# Altium project GMSK Prototyping Board.PrjPcb
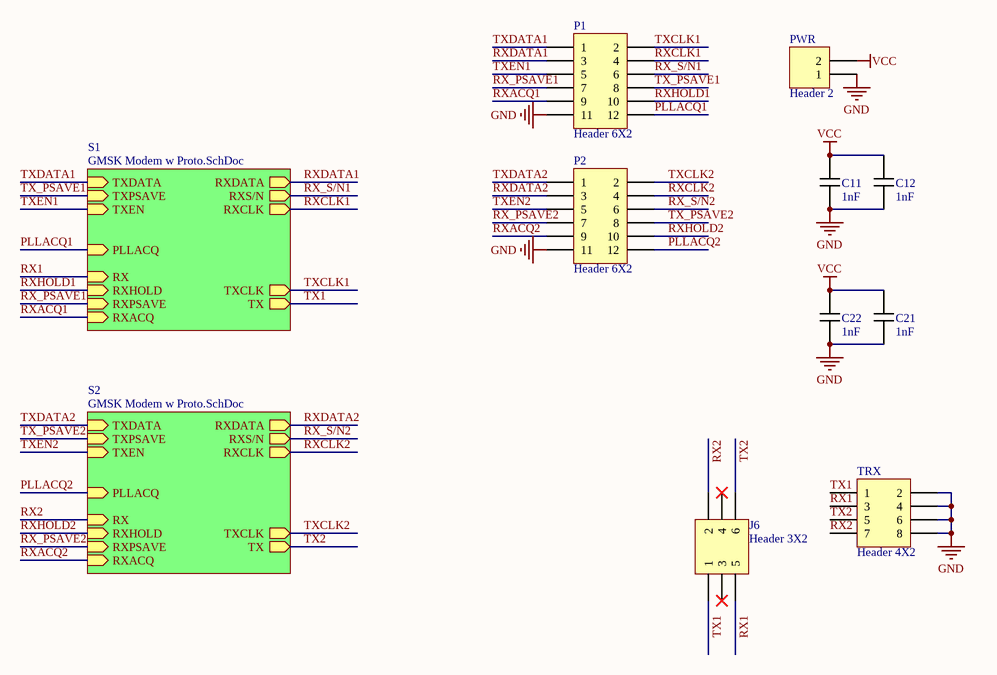
[diagram p0: GMSK Prototyping Board.SchDoc]
2 sheets, 75 parts. Net scope: hierarchical (ports join the sheet entries above them; power ports are global).
Board file: GMSK Prototyping Board.PcbDoc
Sheets:
  GMSK Prototyping Board.SchDoc
    S2 = GMSK Modem w Proto.SchDoc
    S1 = GMSK Modem w Proto.SchDoc

## Sheet GMSK Prototyping Board.SchDoc: GMSK Prototyping Board
size A3; Author: Daniel Jedrychowski; CompanyName: BLUESAT Satellite Project; Engineer: Daniel Jedrychowski; Organization: BLUESat Project; Address1: Room 419; Address2: School of EE&T; Address3: UNSW, NSW 2052; Address4: Australia; DocumentNumber: PAYL0004; SheetNumber: 1; SheetTotal: 2; Description: Board housing 2 GMSK Modems with loopback capability; Version: 1.0

### Parts
C11  value 1nF  [0805 Cap]  (hidden comment: 0805 Cap)
C12  value 1nF  [0805 Cap]  (hidden comment: 0805 Cap)
C21  value 1nF  [0805 Cap]  (hidden comment: 0805 Cap)
C22  value 1nF  [0805 Cap]  (hidden comment: 0805 Cap)
J6  Header 3X2  [HDR2X3]
P1  Header 6X2  [HDR2X6]
P2  Header 6X2  [HDR2X6]
PWR  Header 2  [HDR1X2]
TRX  Header 4X2  [HDR2X4]

### Sub-sheets
S1 = GMSK Modem w Proto.SchDoc: TX (out), RX (in), TXDATA (in), RXDATA (out), RXCLK (out), TXCLK (out), PLLACQ (in), RXACQ (in), TXEN (in), RXHOLD (in), TXPSAVE (in), RXPSAVE (in), RXS/N (out)
S2 = GMSK Modem w Proto.SchDoc: TX (out), RX (in), TXDATA (in), RXDATA (out), RXCLK (out), TXCLK (out), PLLACQ (in), RXACQ (in), TXEN (in), RXHOLD (in), TXPSAVE (in), RXPSAVE (in), RXS/N (out)

### Nets
GND: C11.2 C12.2 C21.1 C22.1 P1.11 P2.11 PWR.1 TRX.2 TRX.4 TRX.6 TRX.8
VCC: C11.1 C12.1 C21.2 C22.2 PWR.2
PLLACQ1: P1.12 ; sheet S1/PLLACQ  [project net PLLACQ]
PLLACQ2: P2.12 ; sheet S2/PLLACQ  [project net PLLACQ]
RX1: J6.5 TRX.3 ; sheet S1/RX  [project net RX]
RX2: J6.2 TRX.7 ; sheet S2/RX  [project net RX]
RX_PSAVE1: P1.7 ; sheet S1/RXPSAVE
RX_PSAVE2: P2.7 ; sheet S2/RXPSAVE
RX_S/N1: P1.6 ; sheet S1/RXS/N
RX_S/N2: P2.6 ; sheet S2/RXS/N
RXACQ1: P1.9 ; sheet S1/RXACQ  [project net RXACQ]
RXACQ2: P2.9 ; sheet S2/RXACQ  [project net RXACQ]
RXCLK1: P1.4 ; sheet S1/RXCLK  [project net RXCLK]
RXCLK2: P2.4 ; sheet S2/RXCLK  [project net RXCLK]
RXDATA1: P1.3 ; sheet S1/RXDATA  [project net RXDATA]
RXDATA2: P2.3 ; sheet S2/RXDATA  [project net RXDATA]
RXHOLD1: P1.10 ; sheet S1/RXHOLD  [project net RXHOLD]
RXHOLD2: P2.10 ; sheet S2/RXHOLD  [project net RXHOLD]
TX1: J6.1 TRX.1 ; sheet S1/TX  [project net TX]
TX2: J6.6 TRX.5 ; sheet S2/TX  [project net TX]
TX_PSAVE1: P1.8 ; sheet S1/TXPSAVE
TX_PSAVE2: P2.8 ; sheet S2/TXPSAVE
TXCLK1: P1.2 ; sheet S1/TXCLK  [project net TXCLK]
TXCLK2: P2.2 ; sheet S2/TXCLK  [project net TXCLK]
TXDATA1: P1.1 ; sheet S1/TXDATA  [project net TXDATA]
TXDATA2: P2.1 ; sheet S2/TXDATA  [project net TXDATA]
TXEN1: P1.5 ; sheet S1/TXEN  [project net TXEN]
TXEN2: P2.5 ; sheet S2/TXEN  [project net TXEN]

Not connected (* = marked no-connect by the designer): J6 3* 4*

### Notes on the sheet
- Title
- Description:
- Size:
- Author:
- Date:
- A3
- Time:
- Version
- Sheet:
- Drawing No.:
- of
- File:

### Library data of the parts
C11 C12 C21 C22 = 0805 MLCC - X7R, 10%
J6 = Header 3X2: Header, 3-Pin, Dual row; LatestRevisionDate: 17-Jul-2002; LatestRevisionNote: Re-released for DXP Platform.; Publisher: Altium Limited
P1 P2 = Header 6X2: Header, 6-Pin, Dual row; LatestRevisionDate: 17-Jul-2002; LatestRevisionNote: Re-released for DXP Platform.; Publisher: Altium Limited
PWR = Header 2: Header, 2-Pin; LatestRevisionDate: 17-Jul-2002; LatestRevisionNote: Re-released for DXP Platform.; Publisher: Altium Limited
TRX = Header 4X2: Header, 4-Pin, Dual row; LatestRevisionDate: 17-Jul-2002; LatestRevisionNote: Re-released for DXP Platform.; Publisher: Altium Limited

## Sheet GMSK Modem w Proto.SchDoc: GMSK Prototyping Board
size A3; CompanyName: BLUESAT Project; Engineer: Daniel Jedrychowski; Organization: BLUESAT Project; Address1: Room 419; Address2: School of EE&T; Address3: UNSW, NSW 2052; Address4: Australia; DocumentNumber: PAYL0005; SheetNumber: 2; SheetTotal: 2; Description: Connections and external components of a GMSK modem; Version: 1.0
Used 2 times, as channels S2, S1. Parts and nets are listed once, with the designators drawn on the sheet.
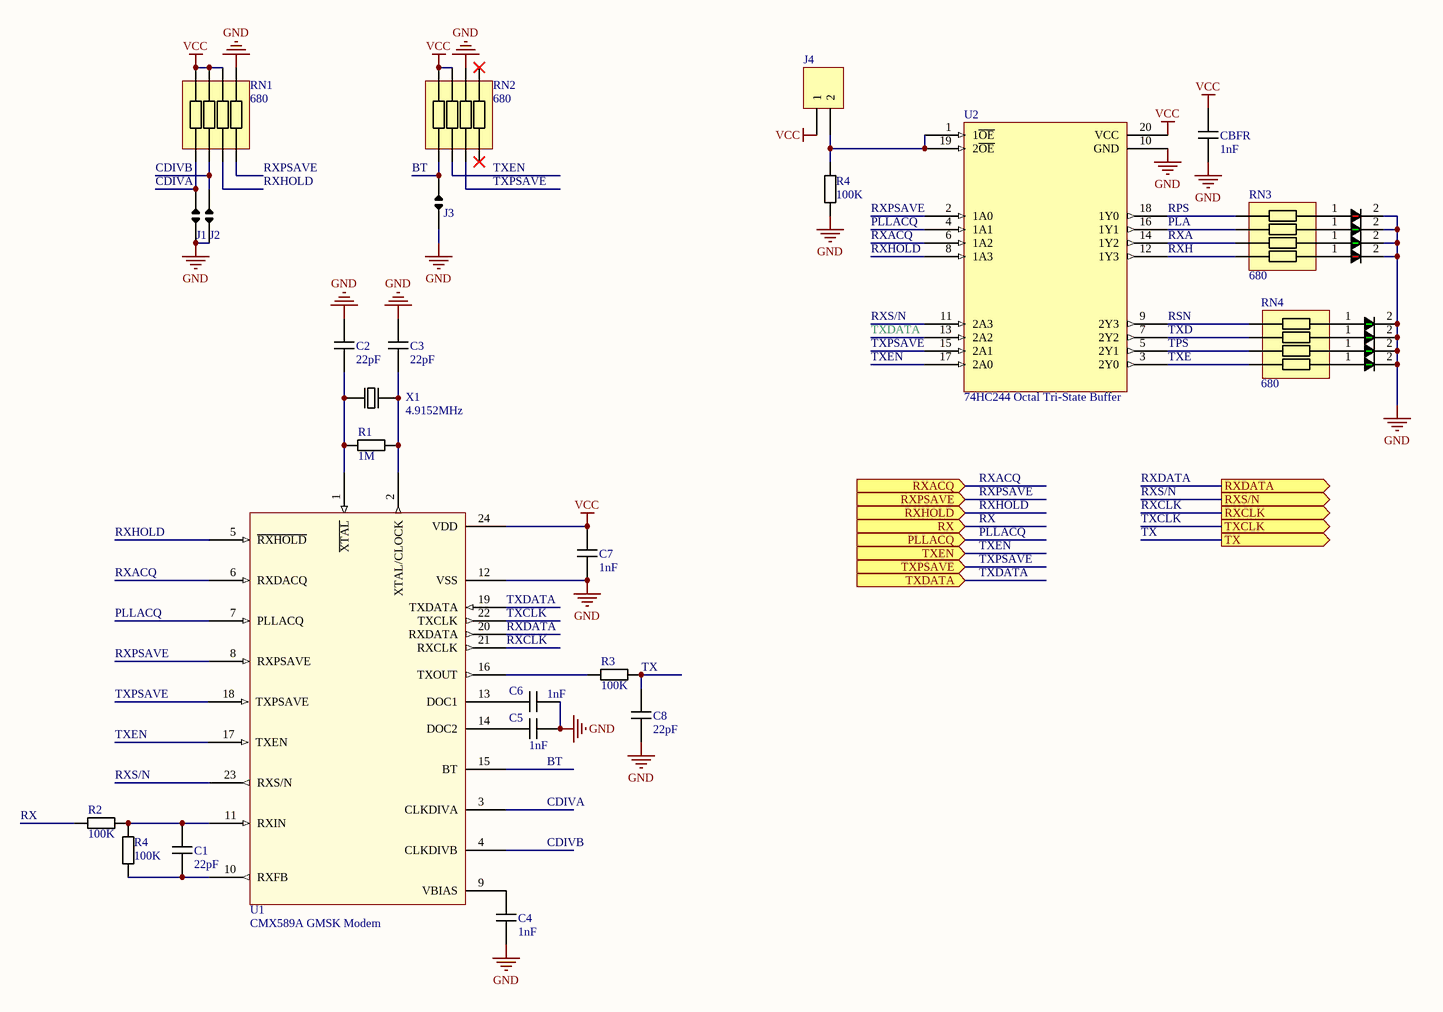
[diagram p1: GMSK Modem w Proto.SchDoc]

### Parts
(Parts that share a designator on the sheet are numbered #1, #2 ... from top to bottom, then left to right.)
C1  value 22pF  [0805 Cap]  (hidden comment: 0805 Cap)
C2  value 22pF  [0805 Cap]  (hidden comment: 0805 Cap)
C3  value 22pF  [0805 Cap]  (hidden comment: 0805 Cap)
C4  value 1nF  [0805 Cap]  (hidden comment: 0805 Cap)
C5  value 1nF  [0805 Cap]  (hidden comment: 0805 Cap)
C6  value 1nF  [0805 Cap]  (hidden comment: 0805 Cap)
C7  value 1nF  [0805 Cap]  (hidden comment: 0805 Cap)
C8  value 22pF  [0805 Cap]  (hidden comment: 0805 Cap)
CBFR  value 1nF  [0805 Cap]  (hidden comment: 0805 Cap)
J1  Jumper  [Solder Jumper C]  (value not drawn)
J2  Jumper  [Solder Jumper C]  (value not drawn)
J3  Jumper  [Solder Jumper C]  (value not drawn)
J4  Header 2  [HDR1X2]  (value not drawn)
PLA1  Green LED  [0603 LED]  (value not drawn)
R1  value 1M  [0805 Resistor]  (hidden comment: 0805 Resistor)
R2  value 100K  [0805 Resistor]  (hidden comment: 0805 Resistor)
R3  value 100K  [0805 Resistor]  (hidden comment: 0805 Resistor)
R4#1  value 100K  [0805 Resistor]  (hidden comment: 0805 Resistor)
R4#2  value 100K  [0805 Resistor]  (hidden comment: 0805 Resistor)
RN1  value 680  [ACAS_0612_AC]  (hidden comment: RN4)
RN2  value 680  [ACAS_0612_AC]  (hidden comment: RN4)
RN3  value 680  [ACAS_0612_AC]  (hidden comment: RN4)
RN4  value 680  [ACAS_0612_AC]  (hidden comment: RN4)
RPS1  Red LED  [0603 LED]  (value not drawn)
RSN1  Green LED  [0603 LED]  (value not drawn)
RXA1  Green LED  [0603 LED]  (value not drawn)
RXH1  Red LED  [0603 LED]  (value not drawn)
TPS1  Green LED  [0603 LED]  (value not drawn)
TXD1  Green LED  [0603 LED]  (value not drawn)
TXE1  Green LED  [0603 LED]  (value not drawn)
U1  CMX589A GMSK Modem  [SOIC24 - GMSK MODEM]
U2  74HC244 Octal Tri-State Buffer  [SOIC20]
X1  value 4.9152MHz  [HC49]  (hidden comment: HC49 Crystal)

### Ports
PLLACQ (in), RX (in), RXACQ (in), RXCLK (out), RXDATA (out), RXHOLD (in), RXPSAVE (in), RXS/N (out), TX (out), TXCLK (out), TXDATA (in), TXEN (in), TXPSAVE (in)

### Nets
GND: C2.2 C3.2 C4.2 C5.2 C6.1 C7.2 C8.2 CBFR.1 J1.1 J2.2 J3.2 PLA1.2 R4#1.1 RN1.1 RN2.6 RPS1.2 RSN1.2 RXA1.2 RXH1.2 TPS1.2 TXD1.2 TXE1.2 U1.12(VSS) U2.10(GND)
VCC: C7.1 CBFR.2 J4.1 RN1.2 RN1.3 RN1.4 RN2.7 RN2.8 U1.24(VDD) U2.20(VCC)
BT: J3.1 RN2.1 U1.15(BT)
CDIVA: J1.2 RN1.5 U1.3(CLKDIVA)
CDIVB: J2.1 RN1.6 U1.4(CLKDIVB)
PLA: RN3.6 U2.16(1Y1)
PLLACQ: U1.7(PLLACQ) U2.4(1A1) ; port PLLACQ
RPS: RN3.5 U2.18(1Y0)
RSN: RN4.5 U2.9(2Y3)
RX: R2.1 ; port RX
RXA: RN3.7 U2.14(1Y2)
RXACQ: U1.6(RXDACQ) U2.6(1A2) ; port RXACQ
RXCLK: U1.21(RXCLK) ; port RXCLK
RXDATA: U1.20(RXDATA) ; port RXDATA
RXH: RN3.8 U2.12(1Y3)
RXHOLD: RN1.7 U1.5(~{RXHOLD}) U2.8(1A3) ; port RXHOLD
RXPSAVE: RN1.8 U1.8(RXPSAVE) U2.2(1A0) ; port RXPSAVE
RXS/N: U1.23(RXS/N) U2.11(2A3) ; port RXS/N
TPS: RN4.7 U2.5(2Y1)
TX: C8.1 R3.2 ; port TX
TXCLK: U1.22(TXCLK) ; port TXCLK
TXD: RN4.6 U2.7(2Y2)
TXDATA: U1.19(TXDATA) U2.13(2A2) ; port TXDATA
TXE: RN4.8 U2.3(2Y0)
TXEN: RN2.2 U1.17(TXEN) U2.17(2A0) ; port TXEN
TXPSAVE: RN2.3 U1.18(TXPSAVE) U2.15(2A1) ; port TXPSAVE
NetC1_1: C1.1 R4#2.2 U1.10(RXFB)
NetC1_2: C1.2 R2.2 R4#2.1 U1.11(RXIN)
NetC2_1: C2.1 R1.1 U1.1(~{XTAL}) X1.1
NetC3_1: C3.1 R1.2 U1.2(XTAL/CLOCK) X1.2
NetC4_1: C4.1 U1.9(VBIAS)
NetC5_1: C5.1 U1.14(DOC2)
NetC6_2: C6.2 U1.13(DOC1)
NetJ4_2: J4.2 R4#1.2 U2.1(1~{OE}) U2.19(2~{OE})
NetPLA1_1: PLA1.1 RN3.3
NetR3_1: R3.1 U1.16(TXOUT)
NetRN3_1: RN3.1 RXH1.1
NetRN3_2: RN3.2 RXA1.1
NetRN3_4: RN3.4 RPS1.1
NetRN4_1: RN4.1 TXE1.1
NetRN4_2: RN4.2 TPS1.1
NetRN4_3: RN4.3 TXD1.1
NetRN4_4: RN4.4 RSN1.1

Not connected (* = marked no-connect by the designer): RN2 4* 5*

### Channels
S2: designators C1=C1#1 C2=C2#1 C3=C3#1 C4=C4#1 C5=C5#1 C6=C6#1 C7=C7#1 C8=C8#1 CBFR=C9#1 J1=CA#1 J2=CB#1 J3=BT#1 J4=BFR#1 PLA1=PA#1 R1=R6#1 R2=R4#2 R3=R3#1 R4=R4#1 R4=R4_S2 RN1=RN1#1 RN2=RN2#1 RN3=RN3#1 RN4=RN4#1 RPS1=RP#1 RSN1=RS#1 RXA1=RA#1 RXH1=RH#1 TPS1=TP#1 TXD1=TD#1 TXE1=TE#1 U1=U1#1 U2=U2#1 X1=X1#1; ports PLLACQ=PLLACQ RX=RX RXACQ=RXACQ RXCLK=RXCLK RXDATA=RXDATA RXHOLD=RXHOLD RXPSAVE=RX_PSAVE2 RXS/N=RX_S/N2 TX=TX TXCLK=TXCLK TXDATA=TXDATA TXEN=TXEN TXPSAVE=TX_PSAVE2
S1: designators C1=C1#2 C2=C2#2 C3=C3#2 C4=C4#2 C5=C5#2 C6=C6#2 C7=C7#2 C8=C8#2 CBFR=C9#2 J1=CA#2 J2=CB#2 J3=BT#2 J4=BFR#2 PLA1=PA#2 R1=R6#2 R2=R4#4 R3=R3#2 R4=R4#3 R4=R4_S1 RN1=RN1#2 RN2=RN2#2 RN3=RN3#2 RN4=RN4#2 RPS1=RP#2 RSN1=RS#2 RXA1=RA#2 RXH1=RH#2 TPS1=TP#2 TXD1=TD#2 TXE1=TE#2 U1=U1#2 U2=U2#2 X1=X1#2; ports PLLACQ=PLLACQ RX=RX RXACQ=RXACQ RXCLK=RXCLK RXDATA=RXDATA RXHOLD=RXHOLD RXPSAVE=RX_PSAVE1 RXS/N=RX_S/N1 TX=TX TXCLK=TXCLK TXDATA=TXDATA TXEN=TXEN TXPSAVE=TX_PSAVE1

### Notes on the sheet
- Title
- Description:
- Size:
- Author:
- Date:
- A3
- Time:
- Version
- Sheet:
- Drawing No.:
- of
- File:

### Library data of the parts
C1-C3 C8 = 0805 MLCC - NP0, 5%
C4-C7 CBFR = 0805 MLCC - X7R, 10%
J1-J3 = Solder Bridge
J4 = Header 2: Header, 2-Pin; LatestRevisionDate: 17-Jul-2002; LatestRevisionNote: Re-released for DXP Platform.; Publisher: Altium Limited
PLA1 RSN1 RXA1 TPS1 TXD1 TXE1 = LED, SMD, GREEN: Chip LED, Green, 0603 Footprint; Farnell Order Number: 1779659
R1-R3 R4#1 R4#2 = 0805 Thin Film Resistor 0.1%
RPS1 RXH1 = LED, SMD, RED: Chip LED, Red, 0603 Footprint; Farnell Order Number: 1779659
U1 = CMX589A
U2 = 74HC244: Octal Non-Inverting Three state buffer

## Nets that join several sheets
GND: GMSK Prototyping Board (11 pins), S2 (24 pins), S1 (24 pins)
VCC: GMSK Prototyping Board (5 pins), S2 (10 pins), S1 (10 pins)
PLLACQ: GMSK Prototyping Board (P1.12), S1 (U1#2.7 U2#2.4)
PLLACQ: GMSK Prototyping Board (P2.12), S2 (U1#1.7 U2#1.4)
RX: GMSK Prototyping Board (J6.2 TRX.7), S2 (R4#2.1)
RX: GMSK Prototyping Board (J6.5 TRX.3), S1 (R4#4.1)
RX_PSAVE1: GMSK Prototyping Board (P1.7), S1 (RN1#2.8 U1#2.8 U2#2.2)
RX_PSAVE2: GMSK Prototyping Board (P2.7), S2 (RN1#1.8 U1#1.8 U2#1.2)
RX_S/N1: GMSK Prototyping Board (P1.6), S1 (U1#2.23 U2#2.11)
RX_S/N2: GMSK Prototyping Board (P2.6), S2 (U1#1.23 U2#1.11)
RXACQ: GMSK Prototyping Board (P1.9), S1 (U1#2.6 U2#2.6)
RXACQ: GMSK Prototyping Board (P2.9), S2 (U1#1.6 U2#1.6)
RXCLK: GMSK Prototyping Board (P1.4), S1 (U1#2.21)
RXCLK: GMSK Prototyping Board (P2.4), S2 (U1#1.21)
RXDATA: GMSK Prototyping Board (P1.3), S1 (U1#2.20)
RXDATA: GMSK Prototyping Board (P2.3), S2 (U1#1.20)
RXHOLD: GMSK Prototyping Board (P1.10), S1 (RN1#2.7 U1#2.5 U2#2.8)
RXHOLD: GMSK Prototyping Board (P2.10), S2 (RN1#1.7 U1#1.5 U2#1.8)
TX: GMSK Prototyping Board (J6.1 TRX.1), S1 (C8#2.1 R3#2.2)
TX: GMSK Prototyping Board (J6.6 TRX.5), S2 (C8#1.1 R3#1.2)
TX_PSAVE1: GMSK Prototyping Board (P1.8), S1 (RN2#2.3 U1#2.18 U2#2.15)
TX_PSAVE2: GMSK Prototyping Board (P2.8), S2 (RN2#1.3 U1#1.18 U2#1.15)
TXCLK: GMSK Prototyping Board (P1.2), S1 (U1#2.22)
TXCLK: GMSK Prototyping Board (P2.2), S2 (U1#1.22)
TXDATA: GMSK Prototyping Board (P1.1), S1 (U1#2.19 U2#2.13)
TXDATA: GMSK Prototyping Board (P2.1), S2 (U1#1.19 U2#1.13)
TXEN: GMSK Prototyping Board (P1.5), S1 (RN2#2.2 U1#2.17 U2#2.17)
TXEN: GMSK Prototyping Board (P2.5), S2 (RN2#1.2 U1#1.17 U2#1.17)